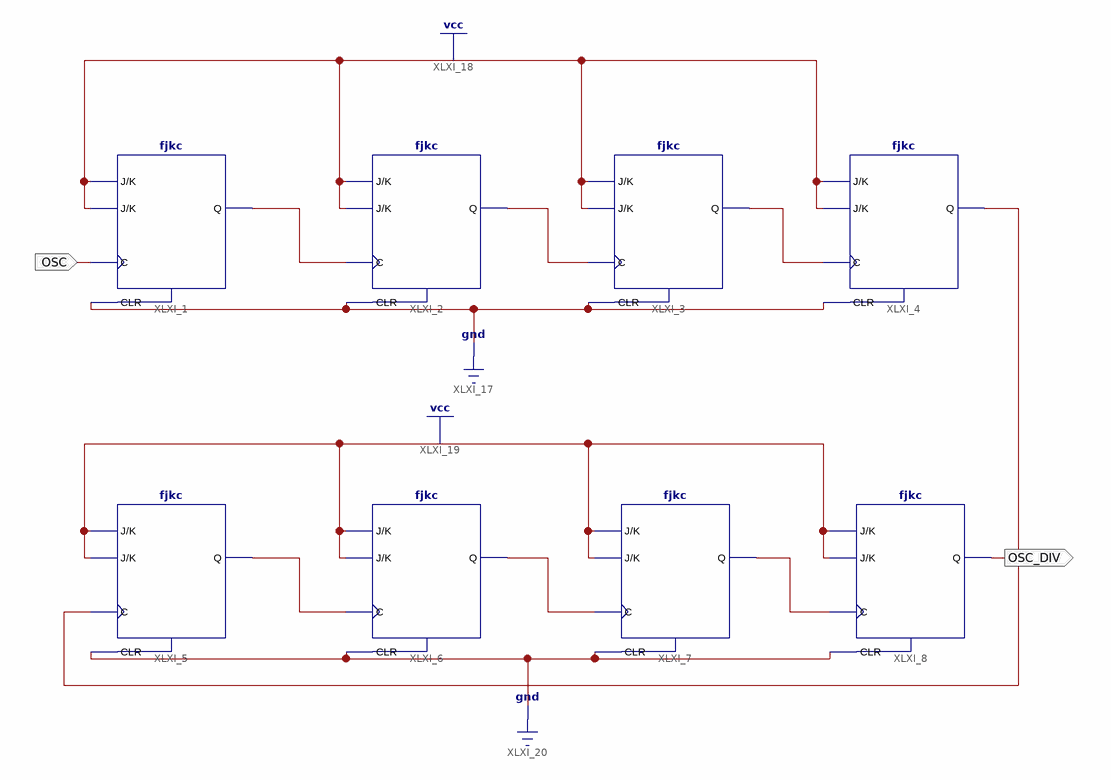
[diagram p0: schematic sheet 1]
// Xilinx ISE schematic Clock_divider.sch (spartan6) as structural Verilog: 8 symbols, 2 ports
module Clock_divider (
  input  OSC,
  output OSC_DIV
);

  wire XLXN_6, XLXN_7, XLXN_8, XLXN_13, XLXN_18, XLXN_19, XLXN_20;

  fjkc XLXI_1 (.C(OSC), .CLR(1'b0), .J(1'b1), .K(1'b1), .Q(XLXN_6));
  fjkc XLXI_2 (.C(XLXN_6), .CLR(1'b0), .J(1'b1), .K(1'b1), .Q(XLXN_7));
  fjkc XLXI_3 (.C(XLXN_7), .CLR(1'b0), .J(1'b1), .K(1'b1), .Q(XLXN_8));
  fjkc XLXI_4 (.C(XLXN_8), .CLR(1'b0), .J(1'b1), .K(1'b1), .Q(XLXN_13));
  fjkc XLXI_5 (.C(XLXN_13), .CLR(1'b0), .J(1'b1), .K(1'b1), .Q(XLXN_18));
  fjkc XLXI_6 (.C(XLXN_18), .CLR(1'b0), .J(1'b1), .K(1'b1), .Q(XLXN_19));
  fjkc XLXI_7 (.C(XLXN_19), .CLR(1'b0), .J(1'b1), .K(1'b1), .Q(XLXN_20));
  fjkc XLXI_8 (.C(XLXN_20), .CLR(1'b0), .J(1'b1), .K(1'b1), .Q(OSC_DIV));
endmodule
